# EAGLE design GoldFishFront (EAGLE 6.5.0)
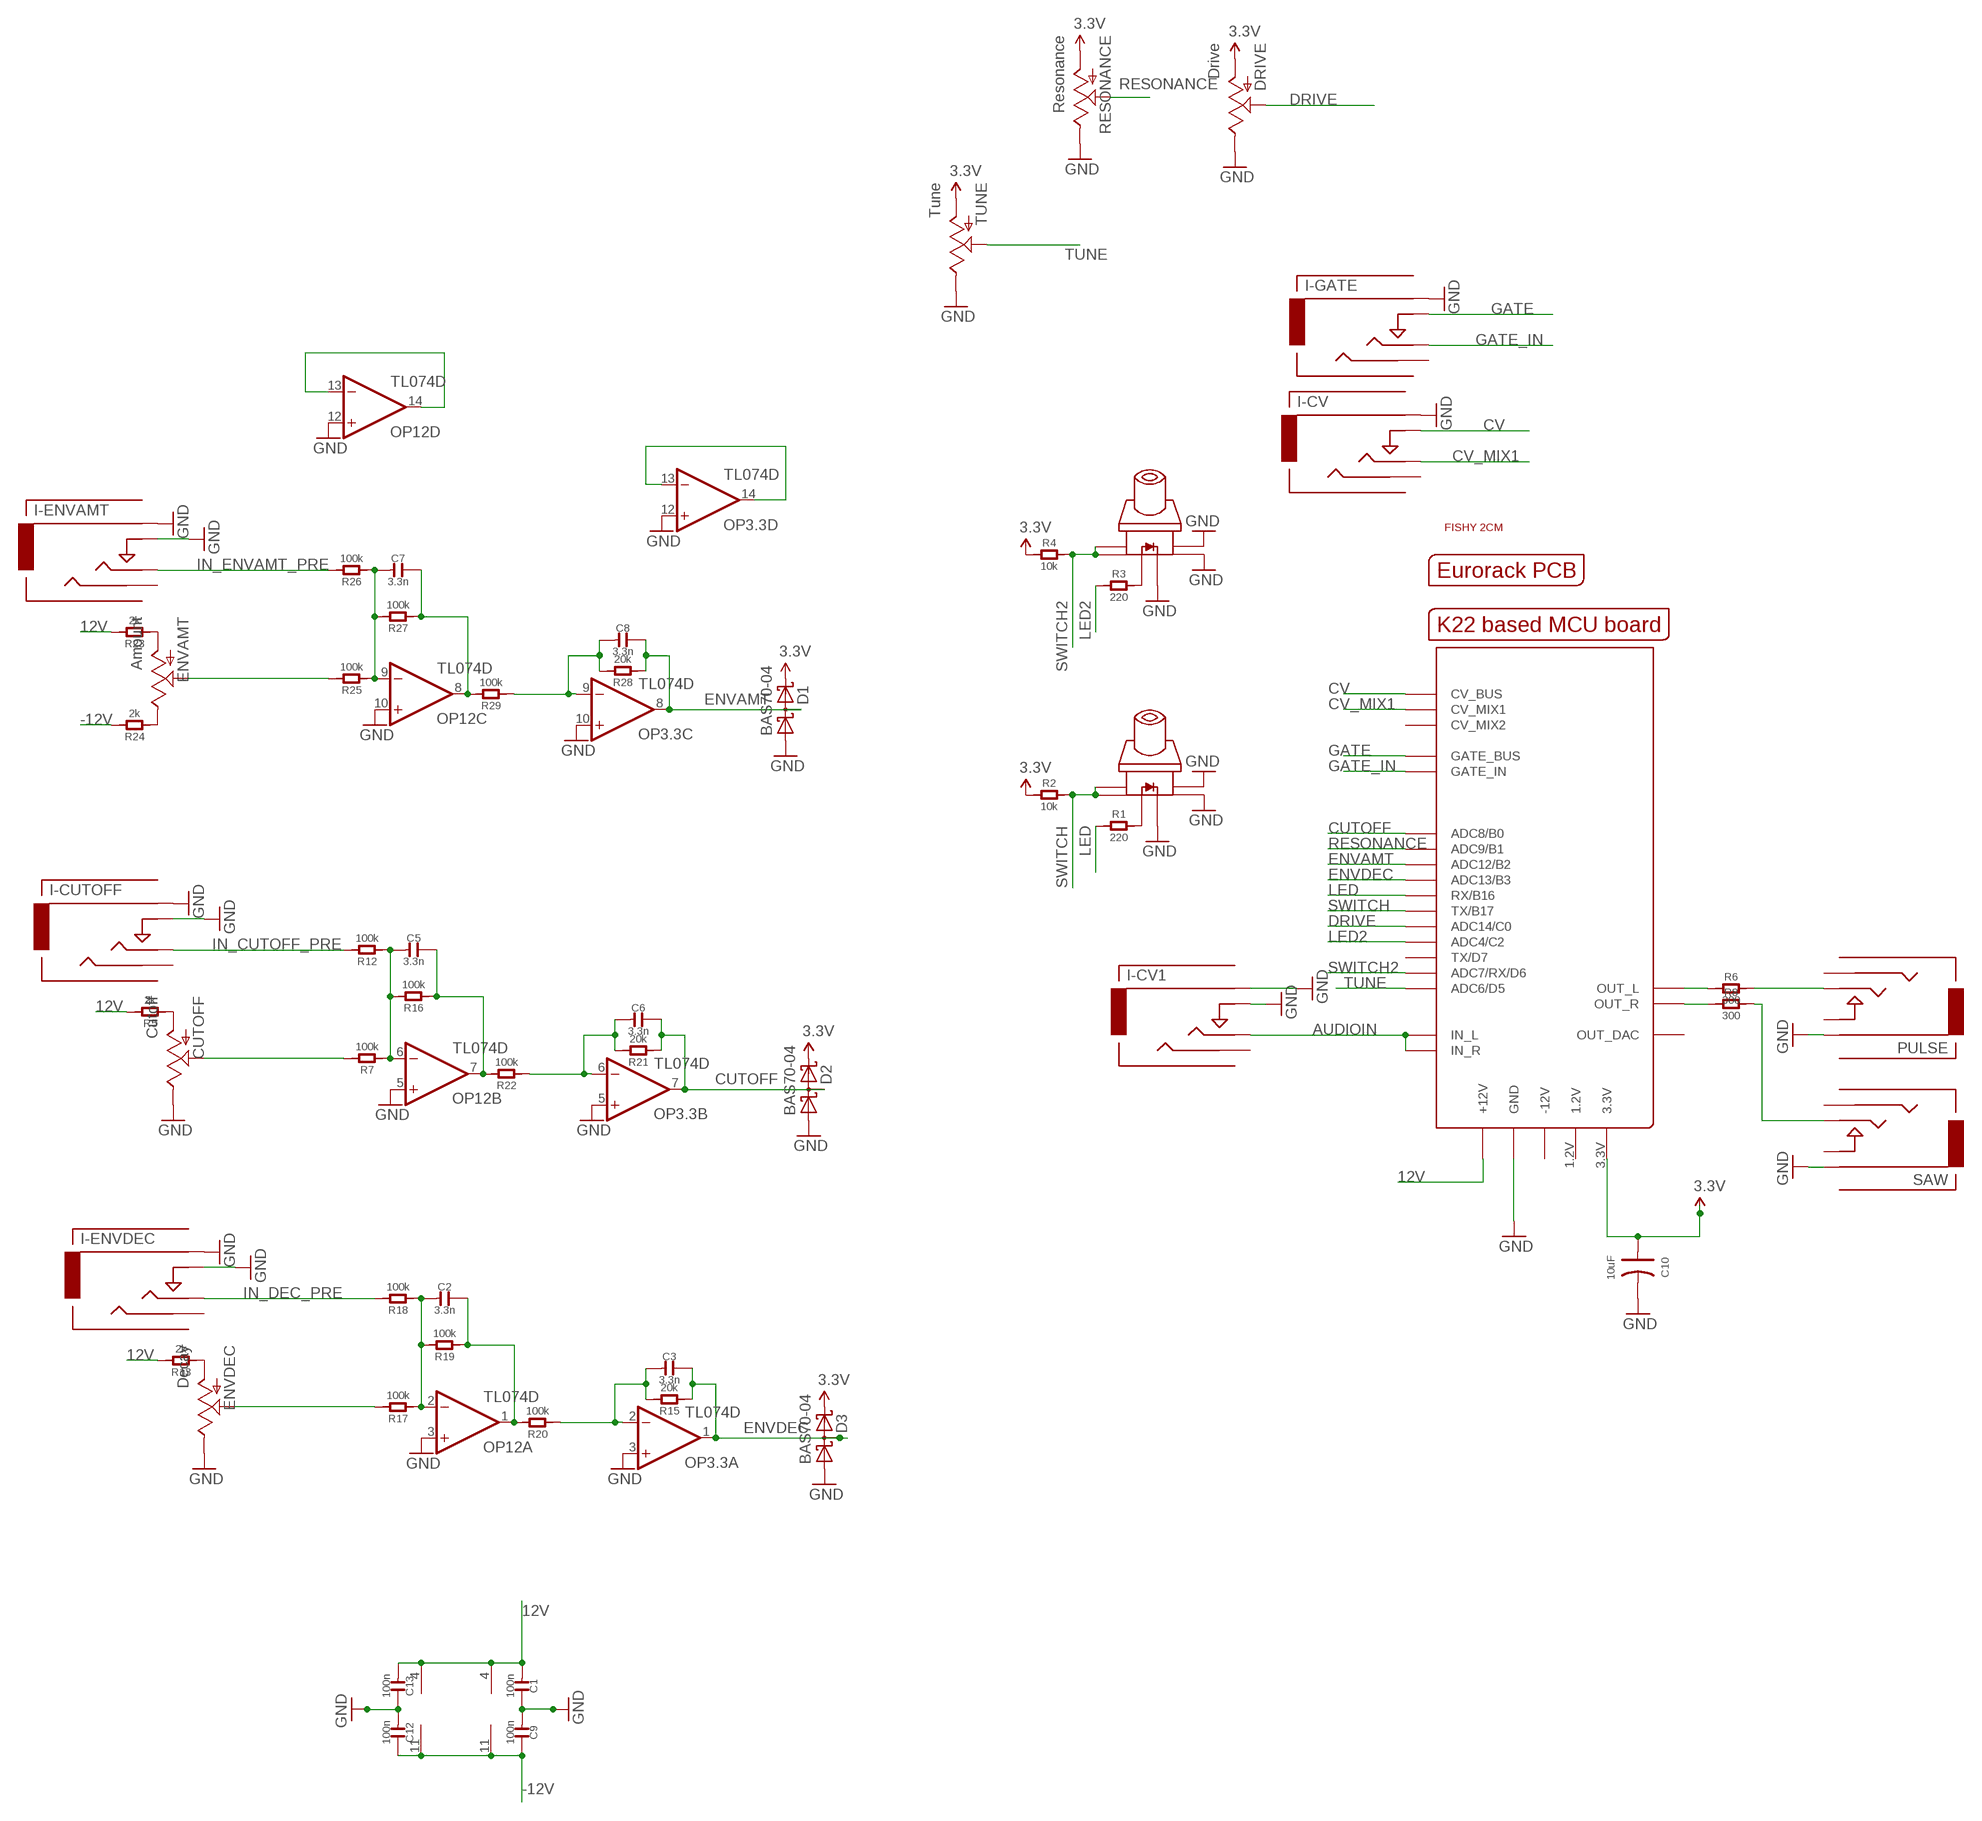
[diagram p0: schematic, sheet 1]

## Parts
C1  100n  C-0603  [C0603]
C2  3.3n  C-0603  [C0603]
C3  3.3n  C-0603  [C0603]
C5  3.3n  C-0603  [C0603]
C6  3.3n  C-0603  [C0603]
C7  3.3n  C-0603  [C0603]
C8  3.3n  C-0603  [C0603]
C9  100n  C-0603  [C0603]
C10  10uF  C-POLAR-A  [AVX-A]
C12  100n  C-0603  [C0603]
C13  100n  C-0603  [C0603]
CUTOFF  Cutoff  POTZEPHPOT  [OG-POTS_ALPS_POT_VERTICAL]
D1  BAS70-04  [SOT23]
D2  BAS70-04  [SOT23]
D3  BAS70-04  [SOT23]
DRIVE  Drive  POTZEPHPOT  [OG-POTS_ALPS_POT_VERTICAL]
ENVAMT  Amount  POTZEPHPOT  [OG-POTS_ALPS_POT_VERTICAL]
ENVDEC  Decay  POTZEPHPOT  [OG-POTS_ALPS_POT_VERTICAL]
I-CUTOFF  Cutoff  AUDIO-JACKINPUT  [3.5MM-JACK-SWITCH-13MM-INPUT]
I-CV  CV  AUDIO-JACKINPUT  [3.5MM-JACK-SWITCH-13MM-INPUT]
I-CV1  External  AUDIO-JACKINPUT  [3.5MM-JACK-SWITCH-13MM-INPUT]
I-ENVAMT  Amount  AUDIO-JACKINPUT  [3.5MM-JACK-SWITCH-13MM-INPUT]
I-ENVDEC  Decay  AUDIO-JACKINPUT  [3.5MM-JACK-SWITCH-13MM-INPUT]
I-GATE  Gate  AUDIO-JACKINPUT  [3.5MM-JACK-SWITCH-13MM-INPUT]
OP3.3  TL074D  [SO14]
OP12  TL074D  [SO14]
PULSE  Pulse  AUDIO-JACKOUTPUT  [3.5MM-JACK-SWITCH-13MM-OUTPUT]
R1  220  R-0603  [R0603]
R2  10k  R-0603  [R0603]
R3  220  R-0603  [R0603]
R4  10k  R-0603  [R0603]
R5  2k  R-0603  [R0603]
R6  300  R  [C0805]
R7  100k  R-0603  [R0603]
R8  300  R  [C0805]
R12  100k  R-0603  [R0603]
R13  2k  R-0603  [R0603]
R15  20k  R-0603  [R0603]
R16  100k  R-0603  [R0603]
R17  100k  R-0603  [R0603]
R18  100k  R-0603  [R0603]
R19  100k  R-0603  [R0603]
R20  100k  R-0603  [R0603]
R21  20k  R-0603  [R0603]
R22  100k  R-0603  [R0603]
R23  2k  R-0603  [R0603]
R24  2k  R-0603  [R0603]
R25  100k  R-0603  [R0603]
R26  100k  R-0603  [R0603]
R27  100k  R-0603  [R0603]
R28  20k  R-0603  [R0603]
R29  100k  R-0603  [R0603]
RESONANCE  Resonance  POTZEPHPOT  [OG-POTS_ALPS_POT_VERTICAL]
SAW  Saw  AUDIO-JACKOUTPUT  [3.5MM-JACK-SWITCH-13MM-OUTPUT]
TUNE  Tune  POTZEPHPOT  [OG-POTS_ALPS_POT_VERTICAL]
U$1  MCUBOARD  [MCUBASEBOARD]
U$2  EURORACK_PCB12HP  [EURORACK12HPPCB]
U$3  FISH2CM_SILK  [FISH_WITHSILK]
U$6  SWITCH_W_LED_PB6149L-X-102WHITE  [PB6149L]
U$17  SWITCH_W_LED_PB6149L-X-102WHITE  [PB6149L]

## Nets
3.3V: C10.+ D1.2(C2) D2.2(C2) D3.2(C2) DRIVE.P$3(A) R2.1 R4.1 RESONANCE.P$3(A) TUNE.P$3(A) U$1.3.3V
12V: C1.1 C13.1 OP3.3.4(P:V+) OP12.4(P:V+) R5.2 R13.2 R23.2 U$1.+12V@1(+12V) U$1.+12V@2(+12V)
-12V: C9.2 C12.2 OP3.3.11(P:V-) OP12.11(P:V-) R24.2
AUDIOIN: I-CV1.TIP@1(TIP) I-CV1.TIP@2(TIP) U$1.IN_L U$1.IN_R
CUTOFF: C6.2 D2.3(C1A2) OP3.3.7(B:OUT) R21.1 U$1.ADC8(ADC8/B0)
CV: I-CV.SWITCH@1(SWITCH) I-CV.SWITCH@2(SWITCH) U$1.CVBUS(CV_BUS)
CV_MIX1: I-CV.TIP@1(TIP) I-CV.TIP@2(TIP) U$1.CV_MIX1
DRIVE: DRIVE.P$2(S) U$1.ADC14(ADC14/C0)
ENVAMT: C8.2 D1.3(C1A2) OP3.3.8(C:OUT) R28.1 U$1.ADC12(ADC12/B2)
ENVDEC: C3.2 D3.3(C1A2) OP3.3.1(A:OUT) R15.1 U$1.ADC13(ADC13/B3)
GATE: I-GATE.SWITCH@1(SWITCH) I-GATE.SWITCH@2(SWITCH) U$1.GATE_BUS
GATE_IN: I-GATE.TIP@1(TIP) I-GATE.TIP@2(TIP) U$1.GATE_IN
GND: C1.2 C9.1 C10.- C12.1 C13.2 CUTOFF.P$1(E) D1.1(A1) D2.1(A1) D3.1(A1) DRIVE.P$1(E) ENVDEC.P$1(E) I-CUTOFF.RING@1(RING) I-CUTOFF.RING@2(RING) I-CUTOFF.SWITCH@1(SWITCH) I-CUTOFF.SWITCH@2(SWITCH) I-CV1.RING@1(RING) I-CV1.RING@2(RING) I-CV1.SWITCH@1(SWITCH) I-CV1.SWITCH@2(SWITCH) I-CV.RING@1(RING) I-CV.RING@2(RING) I-ENVAMT.RING@1(RING) I-ENVAMT.RING@2(RING) I-ENVAMT.SWITCH@1(SWITCH) I-ENVAMT.SWITCH@2(SWITCH) I-ENVDEC.RING@1(RING) I-ENVDEC.RING@2(RING) I-ENVDEC.SWITCH@1(SWITCH) I-ENVDEC.SWITCH@2(SWITCH) I-GATE.RING@1(RING) I-GATE.RING@2(RING) OP3.3.3(A:+IN) OP3.3.5(B:+IN) OP3.3.10(C:+IN) OP3.3.12(D:+IN) OP12.3(A:+IN) OP12.5(B:+IN) OP12.10(C:+IN) OP12.12(D:+IN) PULSE.RING@1(RING) PULSE.RING@2(RING) RESONANCE.P$1(E) SAW.RING@1(RING) SAW.RING@2(RING) TUNE.P$1(E) U$1.GND@1(GND) U$1.GND@2(GND) U$1.GND@4(GND) U$1.GND@5(GND) U$1.GND@6(GND) U$1.GND@7(GND) U$1.GND@8(GND) U$1.GND@9(GND) U$1.GND_BUS(GND) U$6.3 U$6.4 U$6.LEDNEG(NEG) U$17.3 U$17.4 U$17.LEDNEG(NEG)
IN_CUTOFF_PRE: I-CUTOFF.TIP@1(TIP) I-CUTOFF.TIP@2(TIP) R12.2
IN_DEC_PRE: I-ENVDEC.TIP@1(TIP) I-ENVDEC.TIP@2(TIP) R18.2
IN_ENVAMT_PRE: I-ENVAMT.TIP@1(TIP) I-ENVAMT.TIP@2(TIP) R26.2
LED: R1.1 U$1.RX/B16
LED2: R3.1 U$1.ADC4(ADC4/C2)
N$1: PULSE.TIP@1(TIP) PULSE.TIP@2(TIP) R6.2
N$2: R8.2 SAW.TIP@1(TIP) SAW.TIP@2(TIP)
N$3: R6.1 U$1.OUT_L
N$4: R3.2 U$6.LEDPOS(POS)
N$5: CUTOFF.P$3(A) R5.1
N$6: R8.1 U$1.OUT_R
N$7: OP12.13(D:-IN) OP12.14(D:OUT)
N$8: OP3.3.13(D:-IN) OP3.3.14(D:OUT)
N$9: ENVDEC.P$3(A) R13.1
N$10: R1.2 U$17.LEDPOS(POS)
N$12: ENVDEC.P$2(S) R17.2
N$13: C2.1 OP12.2(A:-IN) R17.1 R18.1 R19.2
N$14: C2.2 OP12.1(A:OUT) R19.1 R20.2
N$15: C3.1 OP3.3.2(A:-IN) R15.2 R20.1
N$17: CUTOFF.P$2(S) R7.2
N$18: C5.1 OP12.6(B:-IN) R7.1 R12.1 R16.2
N$19: C5.2 OP12.7(B:OUT) R16.1 R22.2
N$20: C6.1 OP3.3.6(B:-IN) R21.2 R22.1
N$22: ENVAMT.P$3(A) R23.1
N$23: ENVAMT.P$1(E) R24.1
N$24: ENVAMT.P$2(S) R25.2
N$25: C7.1 OP12.9(C:-IN) R25.1 R26.1 R27.2
N$26: C7.2 OP12.8(C:OUT) R27.1 R29.2
N$27: C8.1 OP3.3.9(C:-IN) R28.2 R29.1
RESONANCE: RESONANCE.P$2(S) U$1.ADC9(ADC9/B1)
SWITCH: R2.2 U$1.TX/B17 U$17.1 U$17.2
SWITCH2: R4.2 U$1.ADC7(ADC7/RX/D6) U$6.1 U$6.2
TUNE: TUNE.P$2(S) U$1.ADC6(ADC6/D5)
Unconnected: I-CUTOFF.SECOND@1(SECOND) I-CUTOFF.SECOND@2(SECOND) I-CV1.SECOND@1(SECOND) I-CV1.SECOND@2(SECOND) I-CV.SECOND@1(SECOND) I-CV.SECOND@2(SECOND) I-ENVAMT.SECOND@1(SECOND) I-ENVAMT.SECOND@2(SECOND) I-ENVDEC.SECOND@1(SECOND) I-ENVDEC.SECOND@2(SECOND) I-GATE.SECOND@1(SECOND) I-GATE.SECOND@2(SECOND) PULSE.SECOND@1(SECOND) PULSE.SECOND@2(SECOND) PULSE.SWITCH@1(SWITCH) PULSE.SWITCH@2(SWITCH) SAW.SECOND@1(SECOND) SAW.SECOND@2(SECOND) SAW.SWITCH@1(SWITCH) SAW.SWITCH@2(SWITCH) U$1.1.2V U$1.-12V@1(-12V) U$1.-12V@2(-12V) U$1.CV_MIX2 U$1.OUT_DAC U$1.TX/D7

## Library data of the parts
C1-C3 C5-C9 C12 C13 = OPL:C*
C10 = OPL:C-POLAR*
CUTOFF DRIVE ENVAMT ENVDEC RESONANCE TUNE = EurorackModularParts:POT
D1-D3 = diode:BAS70-04: Silicon Schottky Diodes General-purpose diode for high-speed switching
I-CUTOFF I-CV I-CV1 I-ENVAMT I-ENVDEC I-GATE PULSE SAW = EurorackModularParts:AUDIO-JACK: Switching Mono 3.5mm Audio Jack from Erthenvar.
OP3.3 OP12 = EurorackModularParts:TL074: OP AMP
R1-R8 R12 R13 R15-R29 = OPL:R*
U$1 = EurorackModularParts:MCUBOARD
U$2 = EurorackModularParts:EURORACK_PCB
U$3 = zephod-components:FISH2CM
U$6 U$17 = zephod-components:SWITCH_W_LED_PB6149L-X-102

## Net classes
0 default: width 0.254 mm
1 small: width 0.254 mm

## Board
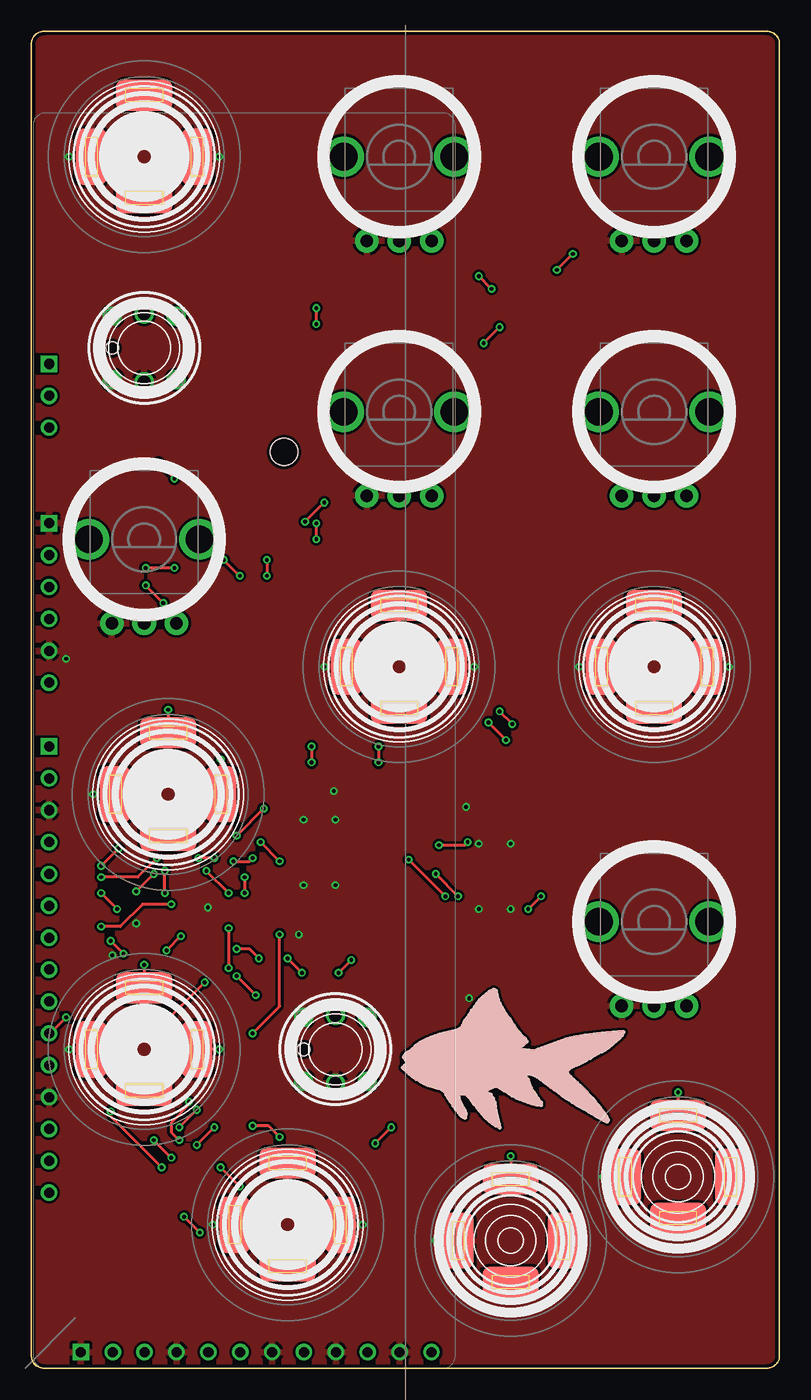
[diagram p1: board, top side]
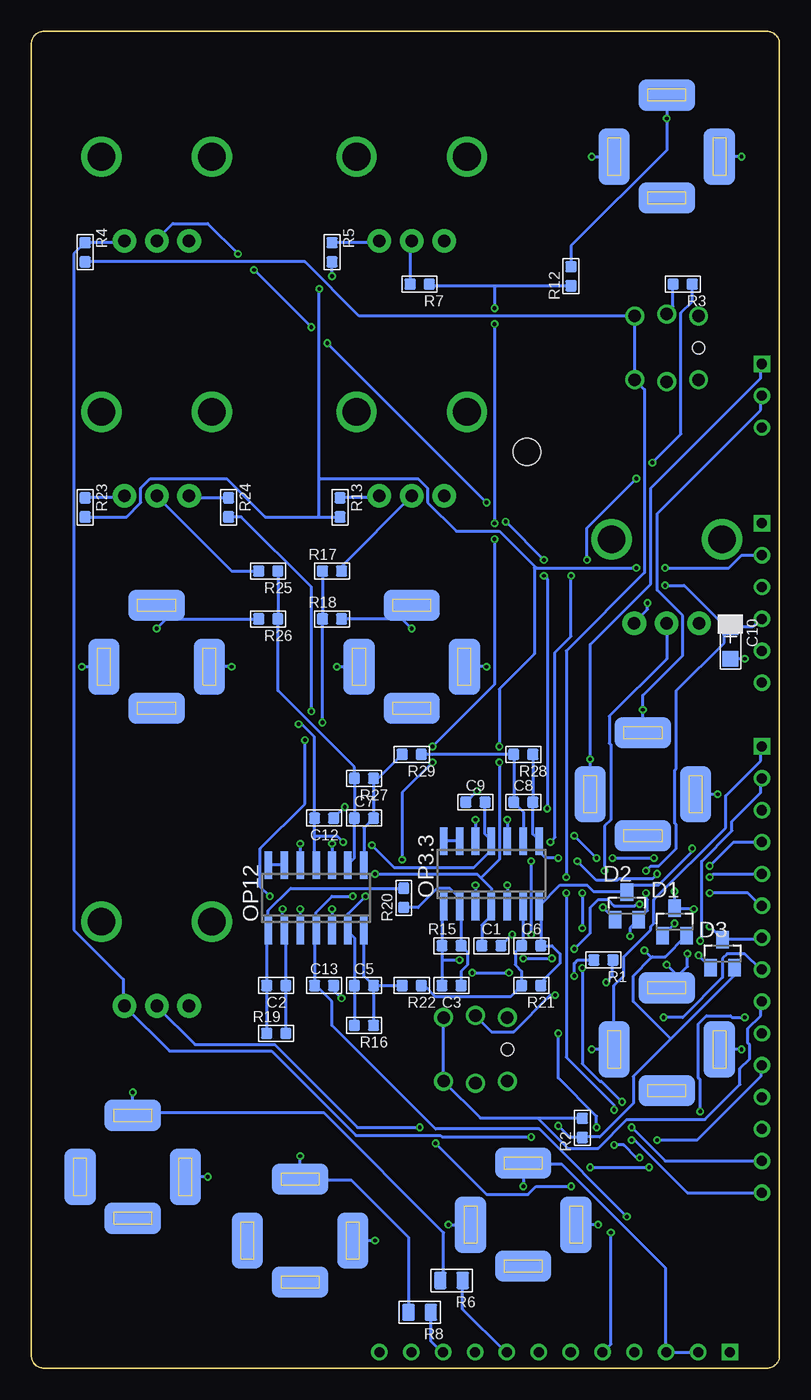
[diagram p2: board, bottom side, seen from below]

Size 59.62 x 106.5 mm. Coordinates in mm from the lower left corner, seen from the top.
Copper layers (1*16): Top 0.035mm / dielectric 1.5mm / Bottom 0.035mm
Design rules "default": minimum track width 6mil, minimum drill 12mil, track to track 8mil, track to pad 8mil, pad to pad 8mil, via to via 8mil, smd to smd 0mil, copper to edge 10mil, drill to drill 10mil, minimum pad ring 10mil, minimum via ring 6mil, stop-mask expansion 2mil, vias tented up to drill 100mil, thermal gap 10mil

### Footprints (pad centres in the part's own frame; a part is rotated, then mirrored left to right if it is on the bottom)
C0603 = smd 0.889 x 0.889: 1 -0.762,0; 2 0.762,0
AVX-A = smd 1.27 x 1.27: + -1.27,0; - 1.27,0
OG-POTS_ALPS_POT_VERTICAL = drill 1 pad 1.88: P$1 -2.58,-6.7; P$2 0,-6.7; P$3 2.58,-6.7 | drill 2.2 pad 3.175: P$4 4.4,0; P$5 -4.4,0
SOT23 = smd 1 x 1.4: 1 -0.95,-1.1; 2 0.95,-1.1; 3 0,1.1
3.5MM-JACK-SWITCH-13MM-INPUT = smd 2.5 x 4.5: RING@1 -4.2,0; SWITCH@1 4.2,0 | smd 2.5 x 4.5 bottom: RING@2 -4.2,0; SWITCH@2 4.2,0 | smd 4.5 x 2.5: SECOND@1 0,-3.3; TIP@1 0,4.9 | smd 4.5 x 2.5 bottom: SECOND@2 0,-3.3; TIP@2 0,4.9
SO14 = smd 0.6 x 2.2: 1 -3.81,-2.6; 2 -2.54,-2.6; 3 -1.27,-2.6; 4 0,-2.6; 5 1.27,-2.6; 6 2.54,-2.6; 7 3.81,-2.6; 8 3.81,2.6; 9 2.54,2.6; 10 1.27,2.6; 11 0,2.6; 12 -1.27,2.6; 13 -2.54,2.6; 14 -3.81,2.6
3.5MM-JACK-SWITCH-13MM-OUTPUT = smd 2.5 x 4.5: RING@1 -4.2,0; SWITCH@1 4.2,0 | smd 2.5 x 4.5 bottom: RING@2 -4.2,0; SWITCH@2 4.2,0 | smd 4.5 x 2.5: SECOND@1 0,-3.3; TIP@1 0,4.9 | smd 4.5 x 2.5 bottom: SECOND@2 0,-3.3; TIP@2 0,4.9
R0603 = smd 0.889 x 0.889: 1 -0.762,0; 2 0.762,0
C0805 = smd 1.016 x 1.397: 1 -0.889,0; 2 0.889,0
MCUBASEBOARD = drill 0.8: 1.2V 1.27,54.61; 3.3V 1.27,59.69; +12V@1 13.97,1.27; +12V@2 1.27,64.77; -12V@1 16.51,1.27; -12V@2 1.27,62.23; ADC4 1.27,24.13; ADC6 1.27,13.97; ADC7 1.27,16.51; ADC8 1.27,41.91; ADC9 1.27,39.37; ADC12 1.27,36.83; ADC13 1.27,34.29; ADC14 1.27,26.67; CV_MIX1 1.27,77.47; CV_MIX2 1.27,74.93; GATE_IN 1.27,46.99; GND@2 11.43,1.27; GND@4 24.13,1.27; GND@5 29.21,1.27; GND@6 1.27,57.15; GND@7 1.27,44.45; GND@8 1.27,21.59; GND@9 19.05,1.27; IN_L 6.35,1.27; IN_R 8.89,1.27; OUT_DAC 31.75,1.27; OUT_L 21.59,1.27; OUT_R 26.67,1.27; RX/B16 1.27,31.75; TX/B17 1.27,29.21; TX/D7 1.27,19.05 | drill 0.8 square: CVBUS 1.27,80.01; GATE_BUS 1.27,49.53; GND@1 3.81,1.27; GND_BUS 1.27,67.31 | hole 2.2: 20,73
PB6149L = drill 1: 1 2.54,2.54; 2 2.54,-2.54; 3 -2.54,2.54; 4 -2.54,-2.54; LEDNEG 0,-2.7; LEDPOS 0,2.7 | hole 1: -2.54,0

### Placement (x,y rotation side)
C1  22.96,33.66 0 bottom
C2  40.1,30.48 180 bottom
C3  26.13,30.48 180 bottom
C5  33.12,30.48 0 bottom
C6  19.78,33.66 0 bottom
C7  33.12,43.81 0 bottom
C8  20.42,45.09 0 bottom
C9  24.23,45.09 0 bottom
C10  3.91,57.78 270 bottom
C12  36.3,43.81 180 bottom
C13  36.3,30.48 0 bottom
CUTOFF  29.31,96.52 0 top
D1  8.36,35.56 0 bottom
D2  12.16,36.83 0 bottom
D3  4.54,33.02 0 bottom
DRIVE  49.63,35.56 0 top
ENVAMT  49.63,76.2 0 top
ENVDEC  29.31,76.2 0 top
I-CUTOFF  8.99,96.52 0 top
I-CV  10.89,45.72 0 top
I-CV1  20.42,11.43 0 top
I-ENVAMT  49.63,55.88 0 top
I-ENVDEC  29.31,55.88 0 top
I-GATE  8.99,25.4 0 top
OP3.3  22.96,39.37 0 bottom
OP12  36.93,37.47 0 bottom
PULSE  51.53,15.24 0 top
R1  14.03,32.51 180 bottom
R2  15.72,19.14 90 bottom
R3  7.72,86.36 180 bottom
R4  55.34,88.9 270 bottom
R5  35.66,88.9 270 bottom
R6  26.13,6.99 180 bottom
R7  28.67,86.36 180 bottom
R8  28.67,4.45 180 bottom
R12  16.61,87 90 bottom
R13  35.02,68.58 270 bottom
R15  26.13,33.66 0 bottom
R16  33.12,27.3 180 bottom
R17  35.66,63.5 0 bottom
R18  35.66,59.69 0 bottom
R19  40.1,26.67 0 bottom
R20  29.95,37.47 90 bottom
R21  19.78,30.48 180 bottom
R22  29.31,30.48 180 bottom
R23  55.34,68.58 270 bottom
R24  43.91,68.58 270 bottom
R25  40.74,63.5 180 bottom
R26  40.74,59.69 180 bottom
R27  33.12,46.99 180 bottom
R28  20.42,48.9 180 bottom
R29  29.31,48.9 180 bottom
RESONANCE  49.63,96.52 0 top
SAW  38.2,10.16 0 top
TUNE  8.99,66.04 0 top
U$1  0.13,0 0 top
U$2  -0.5,0 0 top
U$3  36.91,23.93 0 top
U$6  8.99,81.28 0 top
U$17  24.23,25.4 0 top

### Tracks (layer width: path | path; a pad name or v marks a point on that pad's centre or on a via)
3.3V  (via drill 0.3)
  Top 0.254: v10.51,60.96 v9.12,62.36 | v10.64,37.85 v10.64,39.62 | v11.91,34.42 v10.77,33.27 | v17.63,19.3 18.9,19.3 v19.78,18.41
  Bottom 0.254: C10.+ 2.13,59.05 1.5,59.69 U$1.3.3V | C10.+ 4.29,59.05 7.59,62.36 v9.12,62.36 | v10.51,60.96 10.51,60.45 11.53,59.44 TUNE.P$3 | v10.64,39.62 10.26,40.01 9.62,40.01 8.23,41.4 8.23,43.31 8.36,43.43 8.36,47.62 8.23,47.75 8.23,53.98 4.42,57.78 4.42,59.05 C10.+ | v10.64,37.85 10.64,37.47 10.51,37.34 10.51,36.45 11.15,35.81 D2.2 11.28,35.69 11.91,35.05 v11.91,34.42 | RESONANCE.P$3 52.3,89.79 52.42,89.66 R4.1 56.23,88.77 56.23,34.92 52.3,30.99 52.3,28.96 DRIVE.P$3 52.17,28.83 48.61,25.27 40.49,25.27 33.75,18.54 27.02,18.54 26.9,18.41 v19.78,18.41 | 15.72,18.41 14.32,18.41 11.66,21.08 11.66,23.24 8.67,26.23 | 8.67,26.23 3.66,31.24 3.66,31.88 D3.2 | 10.2,32.7 11.66,31.24 11.66,29.21 8.67,26.23 | 10.2,32.7 10.13,32.77 9.12,32.77 7.47,34.42 D1.2 | v10.77,33.27 10.2,32.7 | 15.72,18.41 16.74,18.41 v17.63,19.3 | 15.72,18.41 R2.1
12V  (via drill 0.3)
  Top 0.254: v34.01,37.59 v32.23,39.37 | v36.68,85.98 v35.66,87 | v11.4,63.75 v9.12,63.75 | v22.32,49.53 v22.32,48.26 | v13.43,10.79 v12.16,12.06
  Bottom 0.254: C1.1 23.72,35.31 22.96,36.07 OP3.3.4 22.96,38.23 23.79,39.05 | 23.79,39.05 24.1,39.37 v32.23,39.37 | v34.01,37.59 35.66,37.59 36.93,36.32 OP12.4 36.93,34.8 37.06,34.67 C13.1 36.93,30.48 35.66,29.21 35.66,27.3 27.4,19.05 19.15,19.05 v12.16,12.06 | 36.68,67.82 40.99,67.82 44.04,70.87 50.14,70.87 50.9,70.1 50.9,68.96 52.04,67.82 R23.2 | 36.68,67.82 R13.2 | v35.66,87 R5.2 | 36.68,67.82 36.68,70.87 | 36.68,70.87 v36.68,85.98 | U$1.+12V@2 3.02,64.77 4.04,63.75 v9.12,63.75 | v11.4,63.75 19.4,63.75 19.47,63.82 | 19.47,63.82 22.32,66.67 25.75,66.67 28.04,68.96 28.04,70.1 28.8,70.87 36.68,70.87 | 23.79,39.05 22.32,40.51 v22.32,48.26 | v22.32,49.53 22.32,54.1 19.53,56.9 19.53,63.75 19.47,63.82 | v13.43,10.79 13.43,1.91 14.07,1.27 U$1.+12V@1
-12V  (via drill 0.3)
  Top 0.254: v38.33,51.31 v37.31,52.32 | v32.48,41.66 34.52,41.66 v34.77,41.91
  Bottom 0.254: C9.2 23.47,42.55 22.96,42.04 OP3.3.11 22.96,41.27 24.36,39.88 30.71,39.88 v32.48,41.66 | 37.06,42.42 37.06,40.26 36.93,40.13 OP12.11 | 37.06,42.42 C12.2 37.06,50.29 38.07,51.31 v38.33,51.31 | R24.2 42.9,67.82 37.31,62.23 v37.31,52.32 | v34.77,41.91 35.28,42.42 37.06,42.42
AUDIOIN  (via drill 0.3)
  Top 0.254: v20.42,14.48 I-CV1.TIP@2
  Bottom 0.254: U$1.IN_L U$1.IN_R 9.12,1.27 9.12,8 17.37,16.26 20.42,16.26 | 20.42,16.26 v20.42,14.48 | 20.42,16.26 I-CV1.TIP@2
CUTOFF  (via drill 0.3)
  Top 0.254: v6.96,41.4 v5.56,40.01
  Bottom 0.254: R21.1 19.02,30.73 17.5,32.26 17.5,33.02 18.13,33.66 C6.2 19.02,36.83 OP3.3.7 19.15,36.83 17.5,38.48 15.34,38.48 14.83,37.97 12.16,37.97 | U$1.ADC8 3.66,41.91 v5.56,40.01 | v6.96,41.4 6.96,41.15 9.62,38.48 11.66,38.48 12.16,37.97 | 12.16,37.97 D2.3
CV  (via drill 0.3)
  Top 0.254: v15.09,48.51 15.09,45.72 I-CV.SWITCH@2
  Bottom 0.254: U$1.CVBUS 1.5,80.01 1.5,78.87 10.26,70.1 10.26,62.48 15.09,57.66 v15.09,48.51 15.09,45.72 I-CV.SWITCH@2
CV_MIX1  (via drill 0.3)
  Top 0.254: v10.89,52.45 I-CV.TIP@2
  Bottom 0.254: I-CV.TIP@2 v10.89,52.45 10.89,53.59 7.72,56.77 7.72,59.94 9.75,61.98 9.75,68.07 1.5,76.33 1.5,77.47 U$1.CV_MIX1
DRIVE  (via drill 0.3)
  Top 0.254: v2.77,27.94 1.5,26.67 U$1.ADC14 | v6.32,20.45 6.32,20.07 v10.39,16 | v16.61,14.48 v15.09,16 | v28.67,19.18 v27.4,17.91
  Bottom 0.254: v2.77,27.94 3.78,27.94 3.91,28.07 5.81,28.07 6.45,27.43 6.45,23.11 6.32,22.99 v6.32,20.45 | v15.09,16 v10.39,16 | v16.61,14.48 19.4,14.48 20.04,13.84 23.34,13.84 v27.4,17.91 | v28.67,19.18 33.63,19.18 40.23,25.78 46.58,25.78 49.63,28.83 DRIVE.P$2
ENVAMT  (via drill 0.3)
  Top 0.254: v5.56,37.85 v6.83,36.58 | v17.63,40.64 17.37,40.39 v16.1,40.39 | v8.36,37.97 v9.75,39.37
  Bottom 0.254: R28.1 C8.2 19.66,42.55 19.15,42.04 OP3.3.8 19.15,41.15 18.64,40.64 v17.63,40.64 | v6.83,36.58 8.36,36.58 D1.3 v8.36,37.97 | v5.56,37.85 2.51,37.85 1.5,36.83 U$1.ADC12 | v16.1,40.39 14.58,38.86 12.93,38.86 12.8,38.99 10.13,38.99 v9.75,39.37
ENVDEC  (via drill 0.3)
  Top 0.254: v5.56,35.18 7.08,35.18 8.86,36.96 v11.15,36.96 | v16.36,33.4 17.37,33.4 v18.13,32.64 | v21.56,31.5 v20.42,32.64 | v25.5,32.51 v24.48,31.5
  Bottom 0.254: 4.54,34.16 1.62,34.16 1.5,34.29 U$1.ADC13 | 26.9,32.51 R15.1 26.9,36.58 26.77,36.7 OP3.3.1 | 26.9,32.51 C3.2 | v5.56,35.18 4.54,34.16 | v11.15,36.96 11.4,36.96 11.53,36.83 13.18,36.83 13.69,37.34 14.45,37.34 15.09,36.7 15.09,34.67 v16.36,33.4 | v20.42,32.64 v18.13,32.64 | v24.48,31.5 v21.56,31.5 | 26.9,32.51 v25.5,32.51 | 4.54,34.16 D3.3
GATE  (via drill 0.3)
  Top 0.254: v14.96,25.4 I-GATE.SWITCH@2
  Bottom 0.254: U$1.GATE_BUS 1.5,49.53 1.5,48.39 4.29,45.59 4.29,43.05 10.01,37.34 10.01,35.43 10.26,35.18 10.26,34.92 12.42,32.77 12.42,31.24 13.18,30.48 I-GATE.SWITCH@2 v14.96,25.4
GATE_IN  (via drill 0.3)
  Top 0.254: v7.34,33.02 v6.32,34.04 | v8.99,32.13 I-GATE.TIP@2
  Bottom 0.254: v6.32,34.04 6.2,34.16 6.2,40.39 3.78,42.8 3.78,43.56 1.5,45.85 1.5,46.99 U$1.GATE_IN | v7.34,33.02 7.34,32 8.1,31.24 | 8.1,31.24 8.99,30.35 I-GATE.TIP@2 8.1,31.24 | 8.1,31.24 v8.99,32.13
GND  (via drill 0.3)
  Bottom 0.254: v21.31,34.54 C1.2 | v24.1,45.97 C9.1 | C13.2 35.53,30.1 v34.9,29.46 | v34.64,44.7 C12.1 | v2.77,56.52 C10.- | v6.45,32.89 5.56,32 D3.1 | v8.36,35.43 9.24,34.54 D1.1 | v14.07,36.7 13.18,35.81 D2.1 | v21.69,38.48 OP3.3.5 | v24.23,38.48 OP3.3.3 | v21.69,43.69 OP3.3.10 | v24.23,43.69 OP3.3.12 | v35.66,36.58 OP12.5 | v38.2,36.58 OP12.3 | v35.66,41.78 OP12.10 | v38.2,41.78 OP12.12 | v14.45,11.43 I-CV1.RING@2 | v3.02,25.4 I-GATE.RING@2 | v26.39,11.43 I-CV1.SWITCH@1 | v32.23,10.16 SAW.RING@2 | v4.93,45.72 I-CV.RING@2 | v45.57,15.24 PULSE.RING@2 | v23.34,55.88 I-ENVDEC.RING@2 | v35.28,55.88 I-ENVDEC.SWITCH@2 | v43.66,55.88 I-ENVAMT.RING@2 | v3.02,96.52 I-CUTOFF.RING@2 | v55.6,55.88 I-ENVAMT.SWITCH@2 | v14.96,96.52 I-CUTOFF.SWITCH@2
  pour Top: -1.17,106.68 59.79,106.68 59.79,0 -1.17,0
IN_CUTOFF_PRE  (via drill 0.3)
  Top 0.254: v8.99,99.57 I-CUTOFF.TIP@2
  Bottom 0.254: R12.2 16.61,89.41 8.99,97.03 v8.99,99.57 I-CUTOFF.TIP@2
IN_DEC_PRE  (via drill 0.3)
  Top 0.254: v29.31,58.93 I-ENVDEC.TIP@2
  Bottom 0.254: R18.2 30.33,59.69 30.2,59.82 | 30.2,59.82 29.31,60.71 I-ENVDEC.TIP@2 30.2,59.82 | 30.2,59.82 v29.31,58.93
IN_ENVAMT_PRE  (via drill 0.3)
  Top 0.254: v49.63,58.93 I-ENVAMT.TIP@2
  Bottom 0.254: R26.2 48.61,59.69 48.74,59.82 | 48.74,59.82 49.63,60.71 I-ENVAMT.TIP@2 48.74,59.82 | 48.74,59.82 v49.63,58.93
LED  (via drill 0.3)
  Top 0.254: v13.82,30.73 11.02,27.94 v9.24,27.94
  Bottom 0.254: v13.82,30.73 13.31,31.24 13.31,32.51 R1.1 | v9.24,27.94 7.72,27.94 4.54,31.11 4.54,32.64 4.16,33.02 2.77,33.02 1.5,31.75 U$1.RX/B16
LED2  (via drill 0.3)
  Top 0.254: v11.4,70.87 v10.13,72.14 | v16.61,63.12 v15.34,64.39 | v19.78,40.39 v18.26,41.91 | v19.78,34.54 19.78,28.83 v17.63,26.67 | v13.18,17.78 v14.58,19.18 | v9.75,18.16 v11.15,16.76
  Bottom 0.254: R3.1 6.96,84.96 7.85,84.07 7.85,74.42 v10.13,72.14 | v11.4,70.87 15.34,66.93 v15.34,64.39 | v16.61,63.12 16.61,58.29 17.88,57.02 17.88,42.29 v18.26,41.91 | v19.78,34.54 v19.78,40.39 | v17.63,26.67 17.63,23.11 14.58,20.07 v14.58,19.18 | v13.18,17.78 12.42,17.78 11.4,16.76 v11.15,16.76 | v9.75,18.16 6.58,18.16 1.5,23.24 1.5,24.13 U$1.ADC4
N$1  (via drill 0.3)
  Top 0.254: v51.53,21.97 PULSE.TIP@2
  Bottom 0.254: 51.53,20.32 v51.53,21.97 | 51.53,20.32 36.3,20.32 26.77,10.79 26.77,6.99 R6.2 | 51.53,20.32 PULSE.TIP@2
N$2  (via drill 0.3)
  Top 0.254: v38.2,16.89 SAW.TIP@2
  Bottom 0.254: R8.2 29.56,10.41 34.14,14.99 38.2,14.99 SAW.TIP@2 v38.2,16.89
N$3
  Bottom 0.254: R6.1 25.25,4.7 21.82,1.27 U$1.OUT_L
N$4
  Bottom 0.254: R3.2 8.48,84.58 8.99,84.07 U$6.LEDPOS
N$5
  Bottom 0.254: R5.1 32.1,89.66 31.98,89.79 CUTOFF.P$3
N$6
  Bottom 0.254: R8.1 27.79,2.16 26.9,1.27 U$1.OUT_R
N$7
  Bottom 0.254: OP12.13 39.47,40.13 40.74,40.13 OP12.14
N$8
  Bottom 0.254: OP3.3.13 25.5,42.04 26.77,42.04 OP3.3.14
N$9
  Bottom 0.254: R13.1 32.1,69.34 31.98,69.47 ENVDEC.P$3
N$10  (via drill 0.3)
  Top 0.254: v17.88,29.72 v16.36,31.24
  Bottom 0.254: R1.2 16.1,32.51 16.36,32.26 v16.36,31.24 | v17.88,29.72 18.26,29.72 21.18,26.8 22.96,26.8 24.23,28.07 U$17.LEDPOS
N$12
  Bottom 0.254: R17.2 34.9,63.88 29.31,69.47 ENVDEC.P$2
N$13  (via drill 0.3)
  Top 0.254: v37.82,50.04 v36.42,51.44 | v39.6,36.58 v40.61,37.59
  Bottom 0.254: R17.1 R18.1 v36.42,51.44 | R19.2 C2.1 39.34,34.67 39.47,34.8 OP12.2 39.47,34.92 39.6,35.05 v39.6,36.58 | v37.82,50.04 37.82,44.96 41.38,41.4 41.38,38.35 v40.61,37.59
N$14
  Bottom 0.254: R19.1 C2.2 40.87,34.67 40.74,34.8 OP12.1 40.74,36.45 38.96,38.23 R20.2
N$15
  Bottom 0.254: C3.1 25.37,31.62 24.86,32.13 24.86,33.15 R15.2 25.37,36.58 25.5,36.7 OP3.3.2 25.5,37.47 26.26,38.23 27.28,38.23 28.8,36.7 R20.1
N$17
  Bottom 0.254: R7.2 29.44,89.66 29.31,89.79 CUTOFF.P$2
N$18  (via drill 0.3)
  Top 0.254: v30.07,40.51 v32.99,37.59 | v27.66,49.53 v27.66,48.26 | v22.71,67.31 v22.71,66.04 | v22.71,84.45 v22.71,83.19
  Bottom 0.254: R16.2 C5.1 33.88,34.29 34.39,34.8 OP12.6 34.39,36.2 v32.99,37.59 | 22.71,86.23 27.79,86.23 R7.1 | 22.71,86.23 R12.1 | v30.07,40.51 30.07,45.85 v27.66,48.26 | v27.66,49.53 22.71,54.48 v22.71,66.04 | v22.71,83.19 v22.71,67.31 | 22.71,86.23 v22.71,84.45
N$19
  Bottom 0.254: C5.2 R16.1 | C5.2 R22.2 | OP12.7 33.12,31.24 C5.2
N$20
  Bottom 0.254: R22.1 28.29,30.48 27.4,29.59 21.44,29.59 R21.2 20.55,31.62 21.05,32.13 21.05,33.15 C6.1 20.42,33.78 OP3.3.6
N$22
  Bottom 0.254: R23.1 52.42,69.34 52.3,69.47 ENVAMT.P$3
N$23
  Bottom 0.254: R24.1 46.84,69.34 46.96,69.47 ENVAMT.P$1
N$24
  Bottom 0.254: R25.2 43.66,63.5 49.63,69.47 ENVAMT.P$2
N$25
  Bottom 0.254: R25.1 R26.1 39.98,53.98 33.88,47.88 R27.2 C7.1 33.88,40.64 34.39,40.13 OP12.9
N$26
  Bottom 0.254: 32.36,46.61 C7.2 33.12,43.05 OP12.8 | 32.36,46.61 R29.2 | 32.36,46.61 R27.1
N$27
  Bottom 0.254: R29.1 R28.2 C8.1 20.42,44.32 OP3.3.9
RESONANCE  (via drill 0.3)
  Top 0.254: v5.56,39.12 8.48,39.12 v10.01,40.64 | v14.58,40.64 v13.31,40.64 | v18.52,44.58 v16.36,42.42 | v18.77,64.39 v18.77,63.12 | v23.34,68.96 v21.82,67.44 | v37.31,82.93 v36.04,81.66 | v43.15,88.77 v41.88,87.5
  Bottom 0.254: U$1.ADC9 5.31,39.37 v5.56,39.12 | v13.31,40.64 v10.01,40.64 | v16.36,42.42 v14.58,40.64 | v18.52,44.58 18.52,62.87 v18.77,63.12 | v21.82,67.44 v18.77,64.39 | v36.04,81.66 v23.34,68.96 | v41.88,87.5 v37.31,82.93 | v43.15,88.77 45.57,91.19 48.36,91.19 49.63,89.92 RESONANCE.P$2
SWITCH
  Bottom 0.254: U$17.1 U$17.2 23.85,19.94 19.28,19.94 | 19.28,19.94 15.72,19.94 R2.2 | 19.28,19.94 16.86,17.53 14.45,17.53 12.16,19.81 5.94,19.81 3.15,22.61 3.15,23.88 2.39,24.64 2.39,25.78 2.51,25.91 2.51,27.05 1.5,28.07 1.5,29.21 U$1.TX/B17
SWITCH2  (via drill 0.3)
  Top 0.254: v13.18,20.57 v11.78,19.18 | v16.99,39.12 v16.99,37.85
  Bottom 0.254: R4.2 37.82,88.14 33.5,83.82 U$6.1 U$6.2 10.77,77.98 10.77,63.37 16.99,57.15 v16.99,39.12 | U$1.ADC7 9.12,16.51 v11.78,19.18 | v13.18,20.57 13.18,20.95 16.99,24.77 v16.99,37.85
TUNE  (via drill 0.3)
  Top 0.254: v11.78,18.16 11.15,18.8 11.15,19.56 12.55,20.95 v12.55,21.21 | v15.72,35.05 v15.72,31.88 | v13.94,39.62 v15.72,37.85
  Bottom 0.254: U$1.ADC6 7.34,13.97 11.53,18.16 v11.78,18.16 | v12.55,21.21 14.2,22.86 14.32,22.86 15.72,24.26 v15.72,31.88 | v15.72,37.85 v15.72,35.05 | v13.94,39.62 13.94,43.18 13.43,43.69 13.43,49.66 13.56,49.78 13.56,51.94 8.99,56.52 TUNE.P$2